# EasyEDA schematic schematic_kcs-01r.json
TITLE: Sheet_1; REV: 1.0; Date: 2020-10-09; Sheet: 1/1; Drawn By: easykp; Company: Your Company
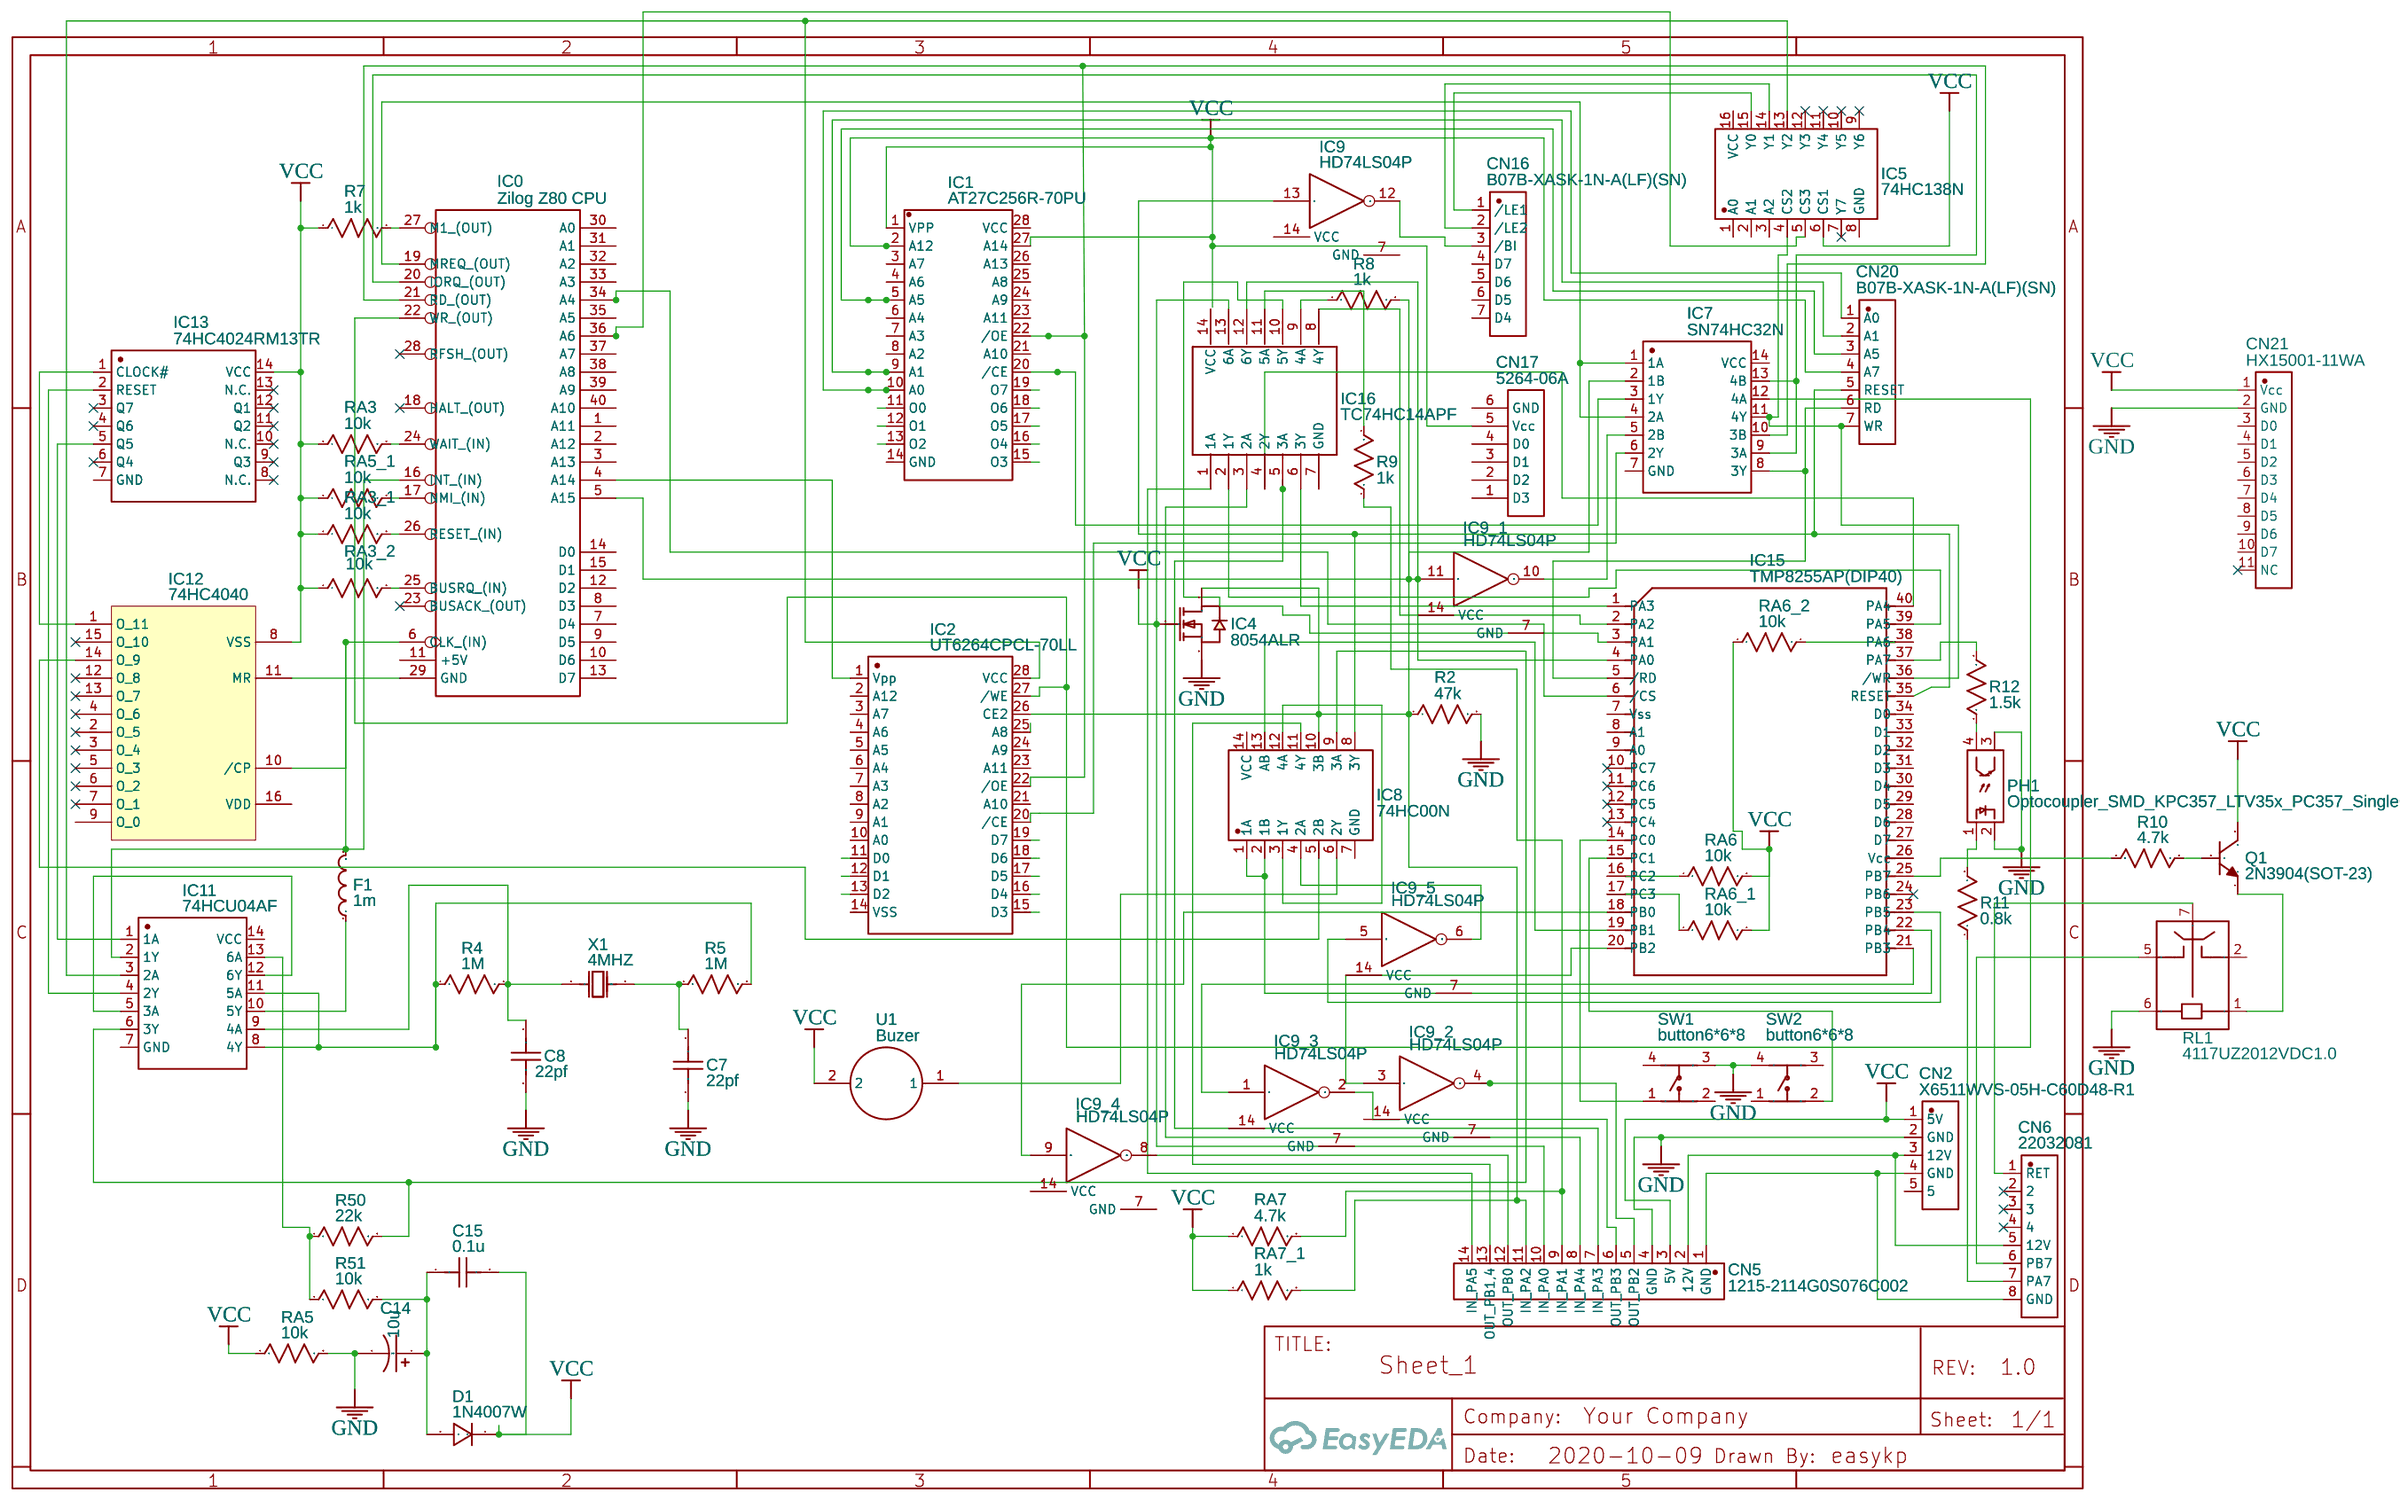
[diagram p0: schematic sheet]

## Parts
C7  22pf  [C0603]
C8  22pf  [C0603]
C14  10u  [CASE-A_3216]
C15  0.1u  [C0603]
CN2  X6511WVS-05H-C60D48-R1  [HDR-SMD_5P-P2.54-V-M-S4.8]
CN5  1215-2114G0S076C002  [HDR-TH_14P-P2.00-V-M]
CN6  22032081  [HDR-TH_8P-P2.54-V-M]
CN16  B07B-XASK-1N-A(LF)(SN)  [CONN-TH_B07B-XASK-1N-A]
CN17  5264-06A  [CONN-TH_6P-P2.50_5264-06A]
CN20  B07B-XASK-1N-A(LF)(SN)  [CONN-TH_B07B-XASK-1N-A]
CN21  HX15001-11WA  [CONN-TH_HX15001-11WA]
D1  1N4007W  [SOD-123_L2.8-W1.8-LS3.7-RD]
F1  1m  [L0603]
IC0  Zilog Z80 CPU  [DIP-40]
IC1  AT27C256R-70PU  [DIP-28-(37X14)]
IC2  UT6264CPCL-70LL  [DIP-28_600MIL]
IC4  8054ALR  [SOT-23_L2.9-W1.3-P0.95-LS2.4-BR]
IC5  74HC138N  [DIP-16_L19.2-W6.6-P2.54-LS7.6-BL]
IC7  SN74HC32N  [DIP-14_L19.0-W7.0-P2.54-LS7.6-BL]
IC8  74HC00N  [DIP-14_L19.0-W7.0-P2.54-LS7.6-BL]
IC9  HD74LS04P  [DIP14]
IC9_1  HD74LS04P  [DIP14]
IC9_2  HD74LS04P  [DIP14]
IC9_3  HD74LS04P  [DIP14]
IC9_4  HD74LS04P  [DIP14]
IC9_5  HD74LS04P  [DIP14]
IC11  74HCU04AF  [SOIC-14_L10.0-W5.5-P1.27-LS7.8-BL]
IC12  74HC4040  [SO16]
IC13  74HC4024RM13TR  [SOIC-14_L8.7-W3.9-P1.27-LS6.0-BL]
IC15  TMP8255AP(DIP40)  [DIP40-2.54-52.3X15.24MM]
IC16  TC74HC14APF  [DIP762W60P254L1975H445Q14N]
PH1  Optocoupler_SMD_KPC357_LTV35x_PC357_SingleChannel  [&#126;]
Q1  2N3904(SOT-23)  [SOT-23-3_L2.9-W1.3-P1.90-LS2.4-TR]
R2  47k  [R0603]
R4  1M  [R0603]
R5  1M  [R0603]
R7  1k  [R0603]
R8  1k  [R0603]
R9  1k  [R0603]
R10  4.7k  [R0603]
R11  0.8k  [R0603]
R12  1.5k  [R0603]
R50  22k  [R0603]
R51  10k  [R0603]
RA3  10k  [R0603]
RA3_1  10k  [R0603]
RA3_2  10k  [R0603]
RA5  10k  [R0603]
RA5_1  10k  [R0603]
RA6  10k  [R0603]
RA6_1  10k  [R0603]
RA6_2  10k  [R0603]
RA7  4.7k  [R0603]
RA7_1  1k  [R0603]
RL1  4117UZ2012VDC1.0  [RELAY-TH_4117UZ2012VDC1.0]
SW1  button6*6*8  [KEY-TH_4P-L6.0-W6.0-P4.50-LS7.5]
SW2  button6*6*8  [KEY-TH_4P-L6.0-W6.0-P4.50-LS7.5]
U1  Buzer  [BUZER PCB]
X1  4MHZ  [HC-49S_L11.0-W4.6-P4.88]

## Library data of the parts
C7 C8 C15 = C_0603_US: Contributor: LCEDA_Lib
C14 = C_Tan_SMD_A_US: Contributor: LCEDA_Lib
CN2 = X6511WVS-05H-C60D48-R1: Supplier: LCSC; Supplier Part: C780063; Manufacturer: XKB Connectivity; Contributor: LCSC
CN5 = 1215-2114G0S076C002: Supplier: LCSC; Supplier Part: C721461; Manufacturer: Wcon; Contributor: LCSC
CN6 = 22032081: Supplier: LCSC; Supplier Part: C586971; Manufacturer: MOLEX; Contributor: LCSC
CN16 CN20 = B07B-XASK-1N-A(LF)(SN): Supplier: LCSC; Supplier Part: C378921; Manufacturer: JST Sales America; Contributor: LCSC
CN17 = 5264-06A: Supplier: LCSC; Manufacturer: ReliaPro; image: //image.lceda.cn/szlcsc/C40160.jpg; Supplier Part: C40160
CN21 = HX15001-11WA: Supplier: LCSC; Supplier Part: C442136; Manufacturer: HX(Zhejiang Yueqing Hongxing Elec); Contributor: LCSC
D1 = 1N4007W: Supplier: LCSC; Supplier Part: C328592; Manufacturer: BLUE ROCKET; Contributor: LCEDA_Lib
F1 = L0603_US: Contributor: LCEDA_Lib
IC0 = Zilog Z80 CPU: Manufacturer: Zilog; Manufacturer Part: Zilog; Supplier: Mouser; Supplier Part: Z84C0020; link: http://www.zilog.com/docs/z80/UM0080.pdf; Contributor: DelboyJay; PINS: 40
IC1 = AT27C256R-70PU: Supplier: LCSC; Supplier Part: C147880; Manufacturer: Microchip Tech; Contributor: LCSC
IC2 = UT6264CPCL-70LL: Supplier: LCSC; Manufacturer: UTRON; Supplier Part: C32483
IC4 = 2N7002: Manufacturer: Nexperia; image: //image.lceda.cn/szlcsc/C65189.jpg; LCSC Assembly: Yes; SMT Type: Extend; Contributor: LCEDA_Lib
IC5 = 74HC138N: Supplier: LCSC; Supplier Part: C507188; Manufacturer: HGSEMI; Contributor: LCSC
IC7 = SN74HC32N: Supplier: LCSC; Manufacturer: TI; image: //image.lceda.cn/szlcsc/C2894.jpg; Supplier Part: C2894
IC8 = 74HC00N: Supplier: LCSC; Supplier Part: C596352; Manufacturer: HTC Korea TAEJIN Tech; Contributor: LCSC
IC9 IC9_1-IC9_5 = HD74LS04P: Hex Inverters; subpart_no: 1
IC11 = 74HCU04AF: Supplier: LCSC; Manufacturer: TOSHIBA; Supplier Part: C8157
IC12 = 74HC4040: Contributor: certaikly
IC13 = 74HC4024RM13TR: Supplier: LCSC; Manufacturer: STMicroelectronics; Supplier Part: C5643
IC15 = MCU-ATMEGA32-16PU(DIP40): Manufacturer Part: ?
IC16 = TC74HC14APF: Contributor: snemelc
PH1 = Optocoupler_SMD_KPC357_LTV35x_PC357_SingleChannel: Contributor: KiCAD; license: https://www.gnu.org/licenses/lgpl-2.1.html
Q1 = 2N3904(SOT-23): Supplier: LCSC; Manufacturer: KEC; Manufacturer Part: 2n3904S-RTK/PS; Supplier Part: C18536; SMT Type: SOT-23; Contributor: LCEDA_Lib
R2 R4 R5 R7-R12 R50 R51 RA3 RA3_1 RA3_2 RA5 RA5_1 RA6 RA6_1 RA6_2 RA7 RA7_1 = R_0603_US: Contributor: LCEDA_Lib
RL1 = 4117UZ2012VDC1.0: Supplier: LCSC; Supplier Part: C165875; Manufacturer: Ningbo Forward Relay Corp; Contributor: LCSC
SW1 SW2 = button6*6*8: Supplier Part: C59982; Supplier: LCSC; Manufacturer: ReliaPro; image: http://image.lceda.cn/szlcsc/C59982.jpg
U1 = Buzer: Contributor: Egorov
X1 = 49SAC04000202080: Supplier: LCSC; Supplier Part: C390748; Manufacturer: JGHC; Contributor: LCSC

## Nets
GND: C7.1 C8.1 C14.2 CN2.2(GND) CN5.4(GND) CN21.2(GND) IC4.2(S) PH1.2 PH1.3 R2.2 RA5.2 RL1.6 SW1.3 SW2.4
VCC: C15.2 CN2.1(5V) CN5.3(5V) CN5.10(IN PA0) CN17.5(Vcc) CN20.4(A7) CN21.1(Vcc) D1.1 IC1.1(VPP) IC1.2(A12) IC1.27(A14) IC4.1(G) IC5.6(CS1) IC12.8(VSS) IC13.14(VCC) IC16.13(6A) Q1.3(C) R7.1 RA3.1 RA3_1.1 RA3_2.1 RA5.1 RA5_1.1 RA6.2 RA6_1.2 RA6_2.1 RA7.1 RA7_1.1 U1.2
Net-(C7-2): C7.2 R5.1 X1.2(OSC2)
Net-(C8-2): C8.2 IC11.9(4A) R4.2 X1.1(OSC1)
Net-(C14-1): C14.1 C15.1 D1.2 R51.2
Net-(CN2-3): CN2.3(12V) CN5.2(12V) CN6.5(12V)
Net-(CN2-4): CN2.4(GND) CN5.1(GND) CN6.8(GND)
Net-(CN5-5): CN5.5(OUT PB2) IC9_2.4(6Y)
Net-(CN5-6): CN5.6(OUT PB3) IC9_3.2(6Y)
Net-(CN5-7): CN5.7(IN PA3) IC16.5(3A)
Net-(CN5-8): CN5.8(IN PA4) IC16.3(2A)
Net-(CN5-9): CN5.9(IN PA1) R9.1 RA7.2
Net-(CN5-11): CN5.11(IN PA2) IC0.5(A15) IC2.26(CE2) IC4.3(D) IC7.2(1B) IC8.10(3B) IC9_1.11(6A) IC15.4(PA0) IC16.12(6Y) R2.1 R8.2 RA7_1.2
Net-(CN5-12): CN5.12(OUT PB0) IC9_4.8(6Y)
Net-(CN5-13): CN5.13(OUT PB1,4) IC8.11(4Y)
Net-(CN5-14): CN5.14(IN PA5) IC16.1(1A)
Net-(CN6-1): CN6.1(RET) RL1.7
Net-(CN6-6): CN6.6(PB7) RL1.5
Net-(CN6-7): CN6.7(PA7) R11.1
Net-(CN16-1): CN16.1(/LE1) IC5.15(Y0)
Net-(CN16-2): CN16.2(/LE2) IC5.14(Y1)
Net-(CN16-3): CN16.3(/BI) IC9.12(6Y)
Net-(CN20-1): CN20.1(A0) IC1.10(A0)
Net-(CN20-2): CN20.2(A1) IC1.9(A1)
Net-(CN20-3): CN20.3(A5) IC1.5(A5)
Net-(CN20-5): CN20.5(RESET) IC8.8(3Y) IC9.13(6A) IC15.35(RESET)
Net-(CN20-6): CN20.6(RD) IC7.8(3Y) IC15.5(/RD)
Net-(CN20-7): CN20.7(WR) IC0.36(A6) IC5.4(CS2) IC5.5(CS3) IC7.11(4Y) IC15.36(/WR)
Net-(F1-1): F1.1 IC11.10(5Y)
Net-(F1-2): F1.2 IC0.6(CLK (IN)) IC0.16(INT (IN)) IC11.2(1Y) IC12.10(/CP)
Net-(IC0-4): IC0.4(A14) IC2.1(Vpp)
Net-(IC0-17): IC0.17(NMI (IN)) RA5_1.2
Net-(IC0-19): IC0.19(MREQ (OUT)) IC7.1(1A) IC7.4(2A)
Net-(IC0-20): IC0.20(IORQ (OUT)) IC7.9(3A) IC7.13(4B)
Net-(IC0-21): IC0.21(RD (OUT)) IC1.22(/OE) IC2.22(/OE) IC7.10(3B)
Net-(IC0-22): IC0.22(WR (OUT)) IC2.27(/WE) IC7.12(4A)
Net-(IC0-24): IC0.24(WAIT (IN)) RA3.2
Net-(IC0-25): IC0.25(BUSRQ (IN)) RA3_2.2
Net-(IC0-26): IC0.26(RESET (IN)) RA3_1.2
Net-(IC0-27): IC0.27(M1 (OUT)) R7.2
Net-(IC0-29): IC0.29(GND) IC12.11(MR)
Net-(IC0-34): IC0.34(A4) IC15.6(/CS)
Net-(IC1-20): IC1.20(/CE) IC7.3(1Y)
Net-(IC2-20): IC2.20(/CE) IC7.6(2Y)
Net-(IC2-28): IC2.28(VCC) IC5.13(Y2) IC11.3(2A)
Net-(IC7-5): IC7.5(2B) IC9_1.10(6Y)
Net-(IC8-1): IC8.1(1A) IC8.2(1B) IC15.22(PB4)
Net-(IC8-3): IC8.3(1Y) IC8.12(4A)
Net-(IC8-4): IC8.4(2A) IC9_5.6(6Y)
Net-(IC8-5): IC8.5(2B) IC12.14(O_9)
Net-(IC8-6): IC8.6(2Y) U1.1
Net-(IC8-9): IC8.9(3A) IC11.6(3Y) R50.2
Net-(IC8-13): IC8.13(AB) IC15.19(PB1)
Net-(IC9_2-3): IC9_2.3(6A) IC9_5.14(VCC) IC15.20(PB2)
Net-(IC9_3-1): IC9_3.1(6A) IC15.21(PB3)
Net-(IC9_4-9): IC9_4.9(6A) IC15.18(PB0)
Net-(IC9_5-5): IC9_5.5(6A) IC15.23(PB5)
Net-(IC11-1): IC11.1(1A) IC13.5(Q5)
Net-(IC11-4): IC11.4(2Y) IC13.2(RESET)
Net-(IC11-5): IC11.5(3A) IC11.12(6Y)
Net-(IC11-8): IC11.8(4Y) IC11.11(5A) R4.1 R5.2
Net-(IC11-13): IC11.13(6A) R50.1 R51.1
Net-(IC12-1): IC12.1(O_11) IC13.1(CLOCK#)
Net-(IC15-1): IC15.1(PA3) IC16.6(3Y)
Net-(IC15-2): IC15.2(PA2) IC16.8(4Y)
Net-(IC15-3): IC15.3(PA1) IC16.10(5Y)
Net-(IC15-14): IC15.14(PC0) SW1.1
Net-(IC15-15): IC15.15(PC1) SW2.2
Net-(IC15-16): IC15.16(PC2) RA6.1
Net-(IC15-17): IC15.17(PC3) RA6_1.1
Net-(IC15-25): IC15.25(PB7) R10.2
Net-(IC15-37): IC15.37(PA7) R12.2
Net-(IC15-38): IC15.38(PA6) RA6_2.2
Net-(IC15-39): IC15.39(PA5) IC16.2(1Y)
Net-(IC15-40): IC15.40(PA4) IC16.4(2Y)
Net-(IC16-9): IC16.9(4A) R8.1
Net-(IC16-11): IC16.11(5A) R9.2
Net-(PH1-1): PH1.1 R11.2
Net-(PH1-4): PH1.4 R12.1
Net-(Q1-1): Q1.1(E) RL1.1
Net-(Q1-2): Q1.2(B) R10.1

Not connected (* = marked no-connect by the designer): CN2 5; CN6 2* 3* 4*; CN16 4(D7) 5(D6) 6(D5) 7(D4); CN17 1(D3) 2(D2) 3(D1) 4(D0) 6(GND); CN21 3(D0) 4(D1) 5(D2) 6(D3) 7(D4) 8(D5) 9(D6) 10(D7) 11(NC)*; IC0 1(A11) 2(A12) 3(A13) 7(D4) 8(D3) 9(D5) 10(D6) 11(+5V) 12(D2) 13(D7) 14(D0) 15(D1) 18(HALT (OUT))* 23(BUSACK (OUT))* 28(RFSH (OUT))* 30(A0) 31(A1) 32(A2) 33(A3) 35(A5) 37(A7) 38(A8) 39(A9) 40(A10); IC1 3(A7) 4(A6) 6(A4) 7(A3) 8(A2) 11(O0) 12(O1) 13(O2) 14(GND) 15(O3) 16(O4) 17(O5) 18(O6) 19(O7) 21(A10) 23(A11) 24(A9) 25(A8) 26(A13) 28(VCC); IC2 2(A12) 3(A7) 4(A6) 5(A5) 6(A4) 7(A3) 8(A2) 9(A1) 10(A0) 11(D0) 12(D1) 13(D2) 14(VSS) 15(D3) 16(D4) 17(D5) 18(D6) 19(D7) 21(A10) 23(A11) 24(A9) 25(A8); IC5 1(A0) 2(A1) 3(A2) 7(Y7)* 8(GND) 9(Y6)* 10(Y5)* 11(Y4)* 12(Y3)* 16(VCC); IC7 7(GND) 14(VCC); IC8 7(GND) 14(VCC); IC9 7(GND) 14(VCC); IC9_1 7(GND) 14(VCC); IC9_2 7(GND) 14(VCC); IC9_3 7(GND) 14(VCC); IC9_4 7(GND) 14(VCC); IC9_5 7(GND); IC11 7(GND) 14(VCC); IC12 2(O_5)* 3(O_4)* 4(O_6)* 5(O_3)* 6(O_2)* 7(O_1)* 9(O_0) 12(O_8)* 13(O_7)* 15(O_10)* 16(VDD); IC13 3(Q7)* 4(Q6)* 6(Q4)* 7(GND) 8(N.C.)* 9(Q3)* 10(N.C.)* 11(Q2)* 12(Q1)* 13(N.C.)*; IC15 7(Vss) 8(A1) 9(A0) 10(PC7)* 11(PC6)* 12(PC5)* 13(PC4)* 24(PB6)* 26(Vcc) 27(D7) 28(D6) 29(D5) 30(D4) 31(D3) 32(D2) 33(D1) 34(D0); IC16 7(GND) 14(VCC); RL1 2; SW1 2 4; SW2 1 3
